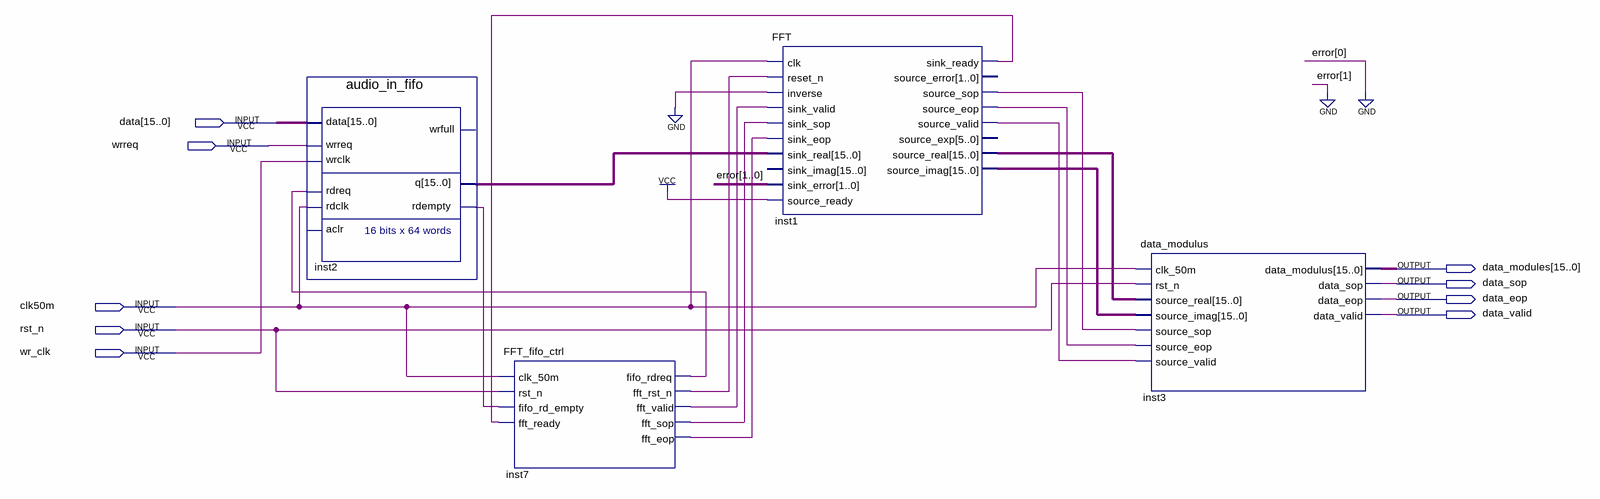
[diagram p0: schematic sheet]
// Quartus schematic FFT_TOP.bdf as structural Verilog: 4 symbols, 9 pins
module FFT_TOP (
  input  [15:0] data,
  input  wrreq,
  input  clk50m,
  input  rst_n,
  input  wr_clk,
  output [15:0] data_modules,
  output data_sop,
  output data_eop,
  output data_valid
);

  wire inst1_sink_ready, inst1_source_eop, inst1_source_sop, inst1_source_valid, inst2_rdempty,
       inst7_fft_eop, inst7_fft_rst_n, inst7_fft_sop, inst7_fft_valid, inst7_fifo_rdreq;
  wire [15:0] inst1_source_imag, inst1_source_real, inst2_q;

  audio_in_fifo inst2 (
    .data(data), .wrreq(wrreq), .wrclk(wr_clk), .rdreq(inst7_fifo_rdreq), .rdclk(clk50m), .q(inst2_q),
    .rdempty(inst2_rdempty));  // open: aclr, wrfull
  FFT_fifo_ctrl inst7 (
    .clk_50m(clk50m), .rst_n(rst_n), .fifo_rd_empty(inst2_rdempty), .fft_ready(inst1_sink_ready),
    .fifo_rdreq(inst7_fifo_rdreq), .fft_rst_n(inst7_fft_rst_n), .fft_valid(inst7_fft_valid),
    .fft_sop(inst7_fft_sop), .fft_eop(inst7_fft_eop));
  FFT inst1 (
    .clk(clk50m), .reset_n(inst7_fft_rst_n), .inverse(1'b0), .sink_valid(inst7_fft_valid),
    .sink_sop(inst7_fft_sop), .sink_eop(inst7_fft_eop), .sink_real(inst2_q), .sink_error(2'b00),
    .source_ready(1'b1), .sink_ready(inst1_sink_ready), .source_sop(inst1_source_sop),
    .source_eop(inst1_source_eop), .source_valid(inst1_source_valid), .source_real(inst1_source_real),
    .source_imag(inst1_source_imag));  // open: sink_imag, source_error, source_exp
  data_modulus inst3 (
    .clk_50m(clk50m), .rst_n(rst_n), .source_real(inst1_source_real), .source_imag(inst1_source_imag),
    .source_sop(inst1_source_sop), .source_eop(inst1_source_eop), .source_valid(inst1_source_valid),
    .data_modulus(data_modules), .data_sop(data_sop), .data_eop(data_eop), .data_valid(data_valid));
endmodule
